# EAGLE design blinkm_mk2b3 (EAGLE 6.4)
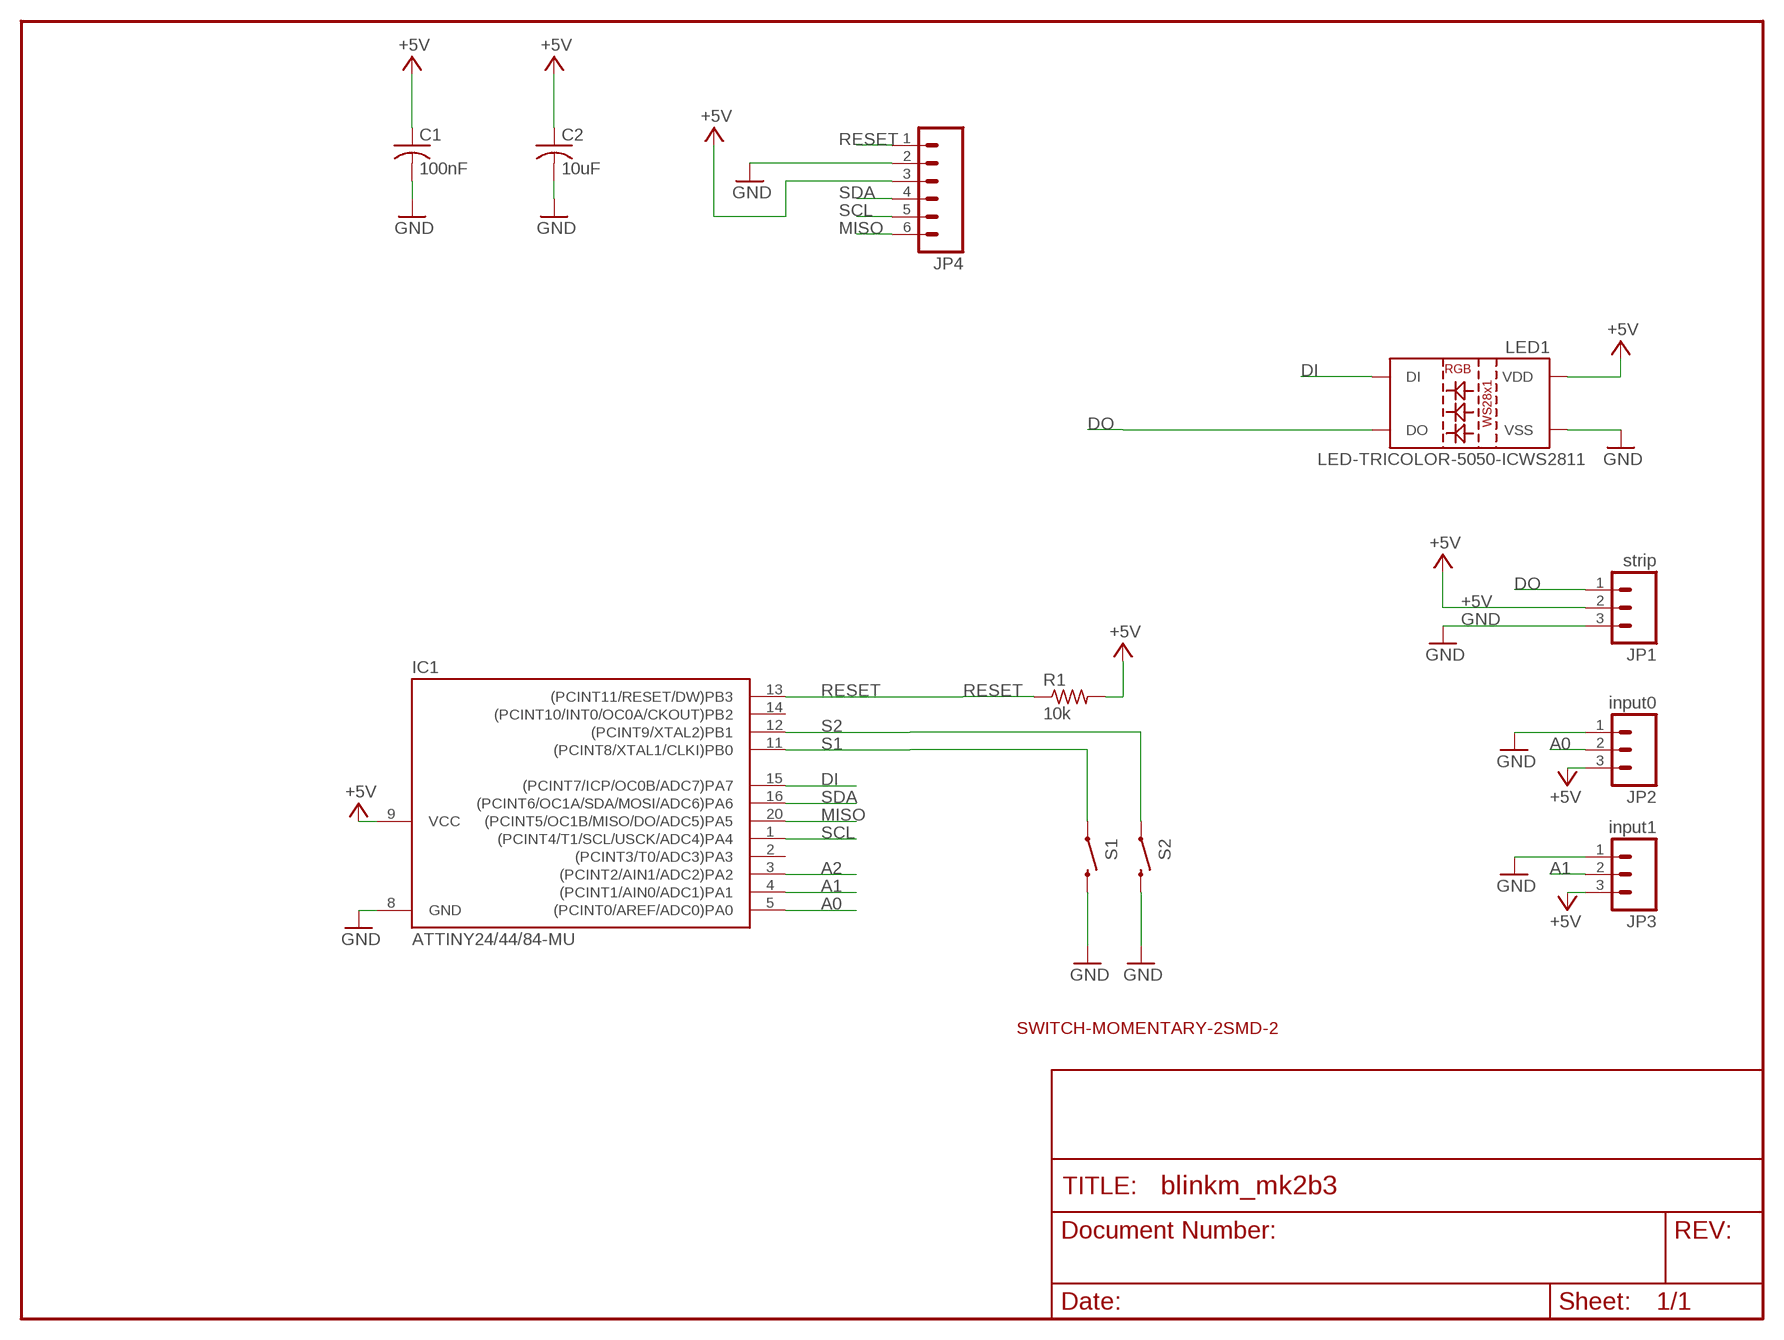
[diagram p0: schematic, sheet 1]

## Parts
C1  100nF  C-USC0603  [C0603]
C2  10uF  C-USC0603  [C0603]
IC1  ATTINY24/44/84-MU  [QFN/MLF20]
JP1  strip  M03PTH  [1X03]
JP2  input0  M03PTH  [1X03]
JP3  input1  M03PTH  [1X03]
JP4  M06SIP  [1X06]
LED1  LED-TRICOLOR-5050-ICWS2811  [LED-TRICOLOR-5050-IC]
R1  10k  R-US_R0603  [R0603]
S1  SWITCH-MOMENTARY-2SMD-2  [TACTILE_SWITCH_SMD-2]
S2  SWITCH-MOMENTARY-2SMD-2  [TACTILE_SWITCH_SMD-2]

## Nets
+5V: C1.1 C2.1 IC1.9(VCC) JP1.2 JP2.3 JP3.3 JP4.3 LED1.3(VDD) LED1.5(VDD) R1.2
A0: IC1.5((PCINT0/AREF/ADC0)PA0) JP2.2
A1: IC1.4((PCINT1/AIN0/ADC1)PA1) JP3.2
A2: IC1.3((PCINT2/AIN1/ADC2)PA2)
DI: IC1.15((PCINT7/ICP/OC0B/ADC7)PA7) LED1.2(DI)
DO: JP1.1 LED1.1(DO)
GND: C1.2 C2.2 IC1.8(GND) JP1.3 JP2.1 JP3.1 JP4.2 LED1.6(VSS) S1.1 S2.1
MISO: IC1.20((PCINT5/OC1B/MISO/DO/ADC5)PA5) JP4.6
RESET: IC1.13((PCINT11/RESET/DW)PB3) JP4.1 R1.1
S1: IC1.11((PCINT8/XTAL1/CLKI)PB0) S1.2
S2: IC1.12((PCINT9/XTAL2)PB1) S2.2
SCL: IC1.1((PCINT4/T1/SCL/USCK/ADC4)PA4) JP4.5
SDA: IC1.16((PCINT6/OC1A/SDA/MOSI/ADC6)PA6) JP4.4
Unconnected: IC1.2((PCINT3/T0/ADC3)PA3) IC1.14((PCINT10/INT0/OC0A/CKOUT)PB2)

## Notes on the sheet
- SWITCH-MOMENTARY-2SMD-2

## Library data of the parts
C1 C2 = rcl:C-US: CAPACITOR, American symbol
IC1 = attiny24_44_84:ATTINY24/44/84
JP1-JP3 = SparkFun-20110517:M03: Header 3 Standard 3-pin 0.1" header. Use with straight break away headers (SKU : PRT-00116), right angle break away headers (PRT-00553), swiss pins (PRT-00743), machine pins (PRT-00117), and female headers (PRT-00115). Molex polarized connector foot print use with SKU : PRT-08232 with associated crimp pins and housings.
JP4 = SparkFun-Connectors:M06: Header 6 Standard 6-pin 0.1" header. Use with straight break away headers (SKU : PRT-00116), right angle break away headers (PRT-00553), swiss pins (PRT-00743), machine pins (PRT-00117), and female headers (PRT-00115). Molex polarized connector foot print use with SKU : PRT-08094 with associated crimp pins and housings. NOTES ON THE VARIANTS LOCK and LOCK_LONGPADS... This footprint was designed to help hold the alignment of a through-hole component (i.e. 6-pin header) while soldering it into place. You may notice that each hole has been shifted either up or down by 0.005 of an inch from it's more standard position (which is a perfectly straight line). This slight alteration caused the pins (the squares in the middle) to touch the edges of the holes. Because they are alternating, it causes a "brace" to hold the component in place. 0.005 has proven to be the perfect amount of "off-center" position when using our standard breakaway headers. Although looks a little odd when you look at the bare footprint, once you have a header in there, the alteration is very hard to notice. Also, if you push a header all the way into place, it is covered up entirely on the bottom side. This idea of altering the position of holes to aid alignment will be further integrated into the Sparkfun Library for other footprints. It can help hold any component with 3 or more connection pins.
LED1 = SparkFun-LED:LED-TRICOLOR-5050-IC: 5x5mm SMD LED with built-in controller IC.
R1 = rcl:R-US_: RESISTOR, American symbol
S1 S2 = SparkFun-Electromechanical:SWITCH-MOMENTARY-2: Various NO switches- pushbuttons, reed, etc

## Board
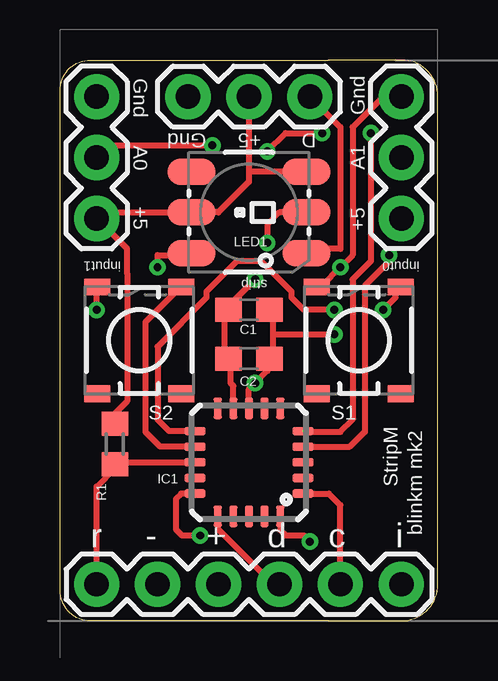
[diagram p1: board, top side]
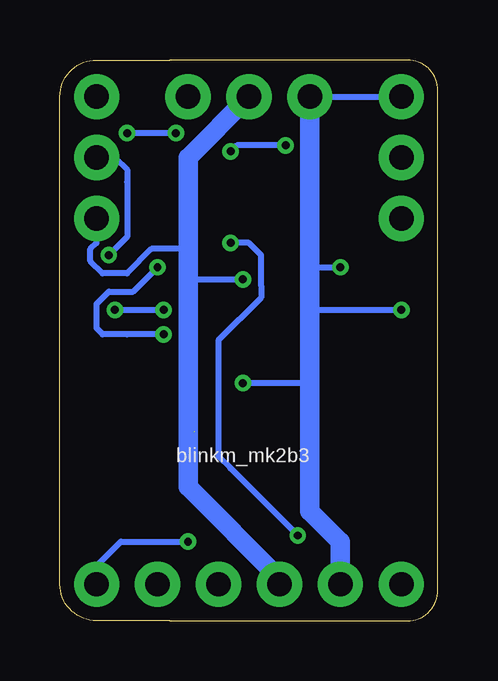
[diagram p2: board, bottom side, seen from below]

Size 15.75 x 23.37 mm. Coordinates in mm from the lower left corner, seen from the top.
Outline: 11.18,0 1.27,0 arc-90 0,1.27 0,22.1 arc-90 1.27,23.37 11.18,23.37 14.22,23.37 arc-90 15.75,21.84 15.75,11.18 15.75,8.64 15.75,1.52 arc-90 14.22,0 11.18,0
Copper layers (1*16): Top 0.0356mm / dielectric 1.5011mm / Bottom 0.0356mm
Design rules "LaenPCBOrder-tod": minimum track width 10mil, minimum drill 13mil, track to track 6mil, track to pad 8mil, pad to pad 8mil, via to via 8mil, smd to smd 6mil, copper to edge 15mil, drill to drill 8mil, minimum pad ring 7mil, minimum via ring 7mil, stop-mask expansion 4mil, vias tented up to drill 25mil, thermal gap 10mil
tRestrict: area 6.6,5.3 to 9.1,7.9

### Footprints (pad centres in the part's own frame; a part is rotated, then mirrored left to right if it is on the bottom)
C0603 = smd 1.1 x 1: 1 -0.85,0; 2 0.85,0
QFN/MLF20 = smd 0.9 x 0.35: 1 -2.25,1.3; 2 -2.25,0.65; 3 -2.25,0; 4 -2.25,-0.65; 5 -2.25,-1.3; 11 2.25,-1.3; 12 2.25,-0.65; 13 2.25,0; 14 2.25,0.65; 15 2.25,1.3 | smd 0.35 x 0.9: 6 -1.3,-2.25; 7 -0.65,-2.25; 8 0,-2.25; 9 0.65,-2.25; 10 1.3,-2.25; 16 1.3,2.25; 17 0.65,2.25; 18 0,2.25; 19 -0.65,2.25; 20 -1.3,2.25
1X03 = drill 1.016 pad 1.88: 1 0,0; 2 2.54,0; 3 5.08,0
1X06 = drill 1.016 pad 1.88: 1 0,0; 2 2.54,0; 3 5.08,0; 4 7.62,0; 5 10.16,0; 6 12.7,0
LED-TRICOLOR-5050-IC = smd 2 x 1.1: 1 -2.4,1.7; 2 -2.4,0; 3 -2.4,-1.7; 4 2.4,-1.7; 5 2.4,0; 6 2.4,1.7
R0603 = smd 1 x 1.1: 1 -0.85,0; 2 0.85,0
TACTILE_SWITCH_SMD-2 = smd 0.7 x 1.1: 1 2.225,1.75; 2 2.225,-1.75; 3 -2.225,-1.75; 4 -2.225,1.75

### Placement (x,y rotation side)
C1  7.87,12.95 0 top
C2  7.87,10.92 0 top
IC1  7.87,6.6 180 top
JP1  10.41,21.84 180 top
JP2  1.52,21.84 270 top
JP3  14.22,21.84 270 top
JP4  1.52,1.52 0 top
LED1  7.87,17.02 180 top
R1  2.29,7.37 90 top
S1  12.45,11.68 90 top
S2  3.3,11.68 90 top

### Tracks (layer width: path | path; a pad name or v marks a point on that pad's centre or on a via)
+5V  (via drill 0.33)
  Top 0.254: LED1.5 5.33,17.02 1.52,17.02 JP2.3 2.79,15.49 2.79,14.48 2.79,9.14 2.29,8.64 R1.2 | 6.86,10.92 C2.1 | 6.86,10.92 6.86,12.95 | 6.86,12.95 C1.1 6.86,12.95 | 6.86,10.92 C2.1 | JP1.2 7.87,19.3 | 7.87,19.3 7.87,18.8 | 6.86,12.95 7.11,13.21 v8.13,14.22 | 5.59,17.02 LED1.5 | 7.22,10.72 C2.1 | 7.87,19.3 7.87,18.8 | 7.87,18.8 7.87,18.29 6.6,17.02 LED1.5 | LED1.3 7.95,18.72 7.87,18.8 | IC1.9 7.22,9.79 7.11,9.91 7.11,10.83 C2.1
  Bottom 0.254: v8.13,14.22 10.16,14.22 10.41,14.22 | JP3.3 14.22,15.75 14.48,15.49 14.48,14.99 13.97,14.48 12.95,14.48 11.94,15.49 10.67,15.49 10.41,15.49
  Bottom 0.813: JP4.3 6.6,1.78 10.41,5.59 10.41,14.22 10.41,15.49 10.41,19.3 JP1.2
A0  (via drill 0.33)  (1 unrouted)
  Top 0.254: v12.95,20.32 12.95,14.99 12.19,14.22 12.19,8.38 11.68,7.87 10.16,7.87 | v10.92,20.32 9.4,20.32 v8.64,19.56 | v6.35,19.81 1.52,19.81 JP2.2
  Bottom 0.254: v10.92,20.32 v12.95,20.32 | v8.64,19.56 8.38,19.81 v6.35,19.81
A1  (via drill 0.33)
  Top 0.254: v13.72,15.24 13.72,14.99 12.7,13.97 12.7,7.87 12.08,7.25 IC1.4
  Bottom 0.254: v13.72,15.24 12.95,16 12.95,18.29 12.95,18.8 13.46,19.3 JP3.2
DI  (via drill 0.33)
  Top 0.254: LED1.2 10.16,17.02 9.14,17.02 8.64,16.51 v8.64,15.75 | IC1.15 5.05,5.3 4.83,5.08 4.83,3.81 5.08,3.56 v5.84,3.56
  Bottom 0.254: v5.84,3.56 8.64,6.35 9.14,6.86 9.14,11.43 9.14,11.68 7.37,13.46 7.37,13.97 7.37,15.24 7.87,15.75 v8.64,15.75
DO
  Top 0.254: JP1.1 11.68,20.57 11.68,15.49 10.41,15.49 LED1.1
GND  (via drill 0.33)
  Top 0.254: JP3.1 13.46,21.84 12.19,20.57 12.19,15.24 v11.68,14.73 10.92,13.97 S1.1 | 7.87,8.89 IC1.8 | 7.87,8.89 IC1.8 | 7.87,8.89 IC1.8 | 8.89,11.94 8.89,10.92 C2.2 8.64,10.92 8.64,10.41 v8.13,9.91 7.87,9.65 7.87,8.89 | 8.89,11.94 8.89,12.95 C1.2 | v1.52,12.95 1.52,13.72 1.78,13.72 S2.1 | v4.06,14.73 4.06,15.24 5.33,15.24 LED1.6 | 8.89,11.94 v11.43,11.94
  Bottom 0.254: v1.52,12.95 5.08,12.95 5.33,12.95 | v4.06,14.73 5.08,14.73 5.33,14.73 | v8.13,9.91 5.59,9.91 5.33,9.91 | JP2.1 5.08,21.84 JP1.3 | v11.68,14.73 12.7,13.72 13.72,13.72 14.22,13.21 14.22,12.19 13.97,11.94 12.95,11.94 v11.43,11.94
  Bottom 0.813: JP1.3 5.33,14.73 5.33,12.95 5.33,9.91 5.33,4.57 4.06,3.3 JP4.2
  pour Bottom: 21.59,22.86 21.59,0 20.07,0 20.07,22.86
MISO  (via drill 0.33)
  Top 0.254: IC1.20 9.17,3.78 9.4,3.56 10.16,3.56 v10.41,3.3
  Bottom 0.254: JP4.6 14.22,2.29 13.21,3.3 v10.41,3.3
RESET
  Top 0.254: IC1.13 5.59,6.6 2.29,6.6 R1.1 2.29,6.35 1.52,5.59 JP4.1
S1  (via drill 0.33)
  Top 0.254: v11.43,12.95 10.16,12.95 9.65,13.46 9.65,13.72 8.89,14.48 8.38,14.99 7.37,14.99 6.1,13.72 6.1,13.46 4.06,11.43 4.06,8.38 4.54,7.9 IC1.11 | v13.46,12.95 13.97,13.46 13.97,13.72 S1.2
  Bottom 0.254: v13.46,12.95 v11.43,12.95
S2
  Top 0.254: S2.2 4.83,13.72 3.56,12.45 3.56,7.87 4.18,7.25 IC1.12
SCL
  Top 0.254: JP4.5 11.68,4.83 11.21,5.3 IC1.1
SDA
  Top 0.254: JP4.4 8.89,1.52 6.6,3.81 6.6,4.32 IC1.16

### Text on the board
tPlace: Gnd | Gnd | A0 | Gnd | +5 | D | A1 | +5 | +5 | input1 | input0 | strip | StripM | blinkm mk2 | r | - | + | d | c | i
bPlace: blinkm_mk2b3